# EAGLE design a12008mb (EAGLE 9.2.2)

## Sheet 1 of 3
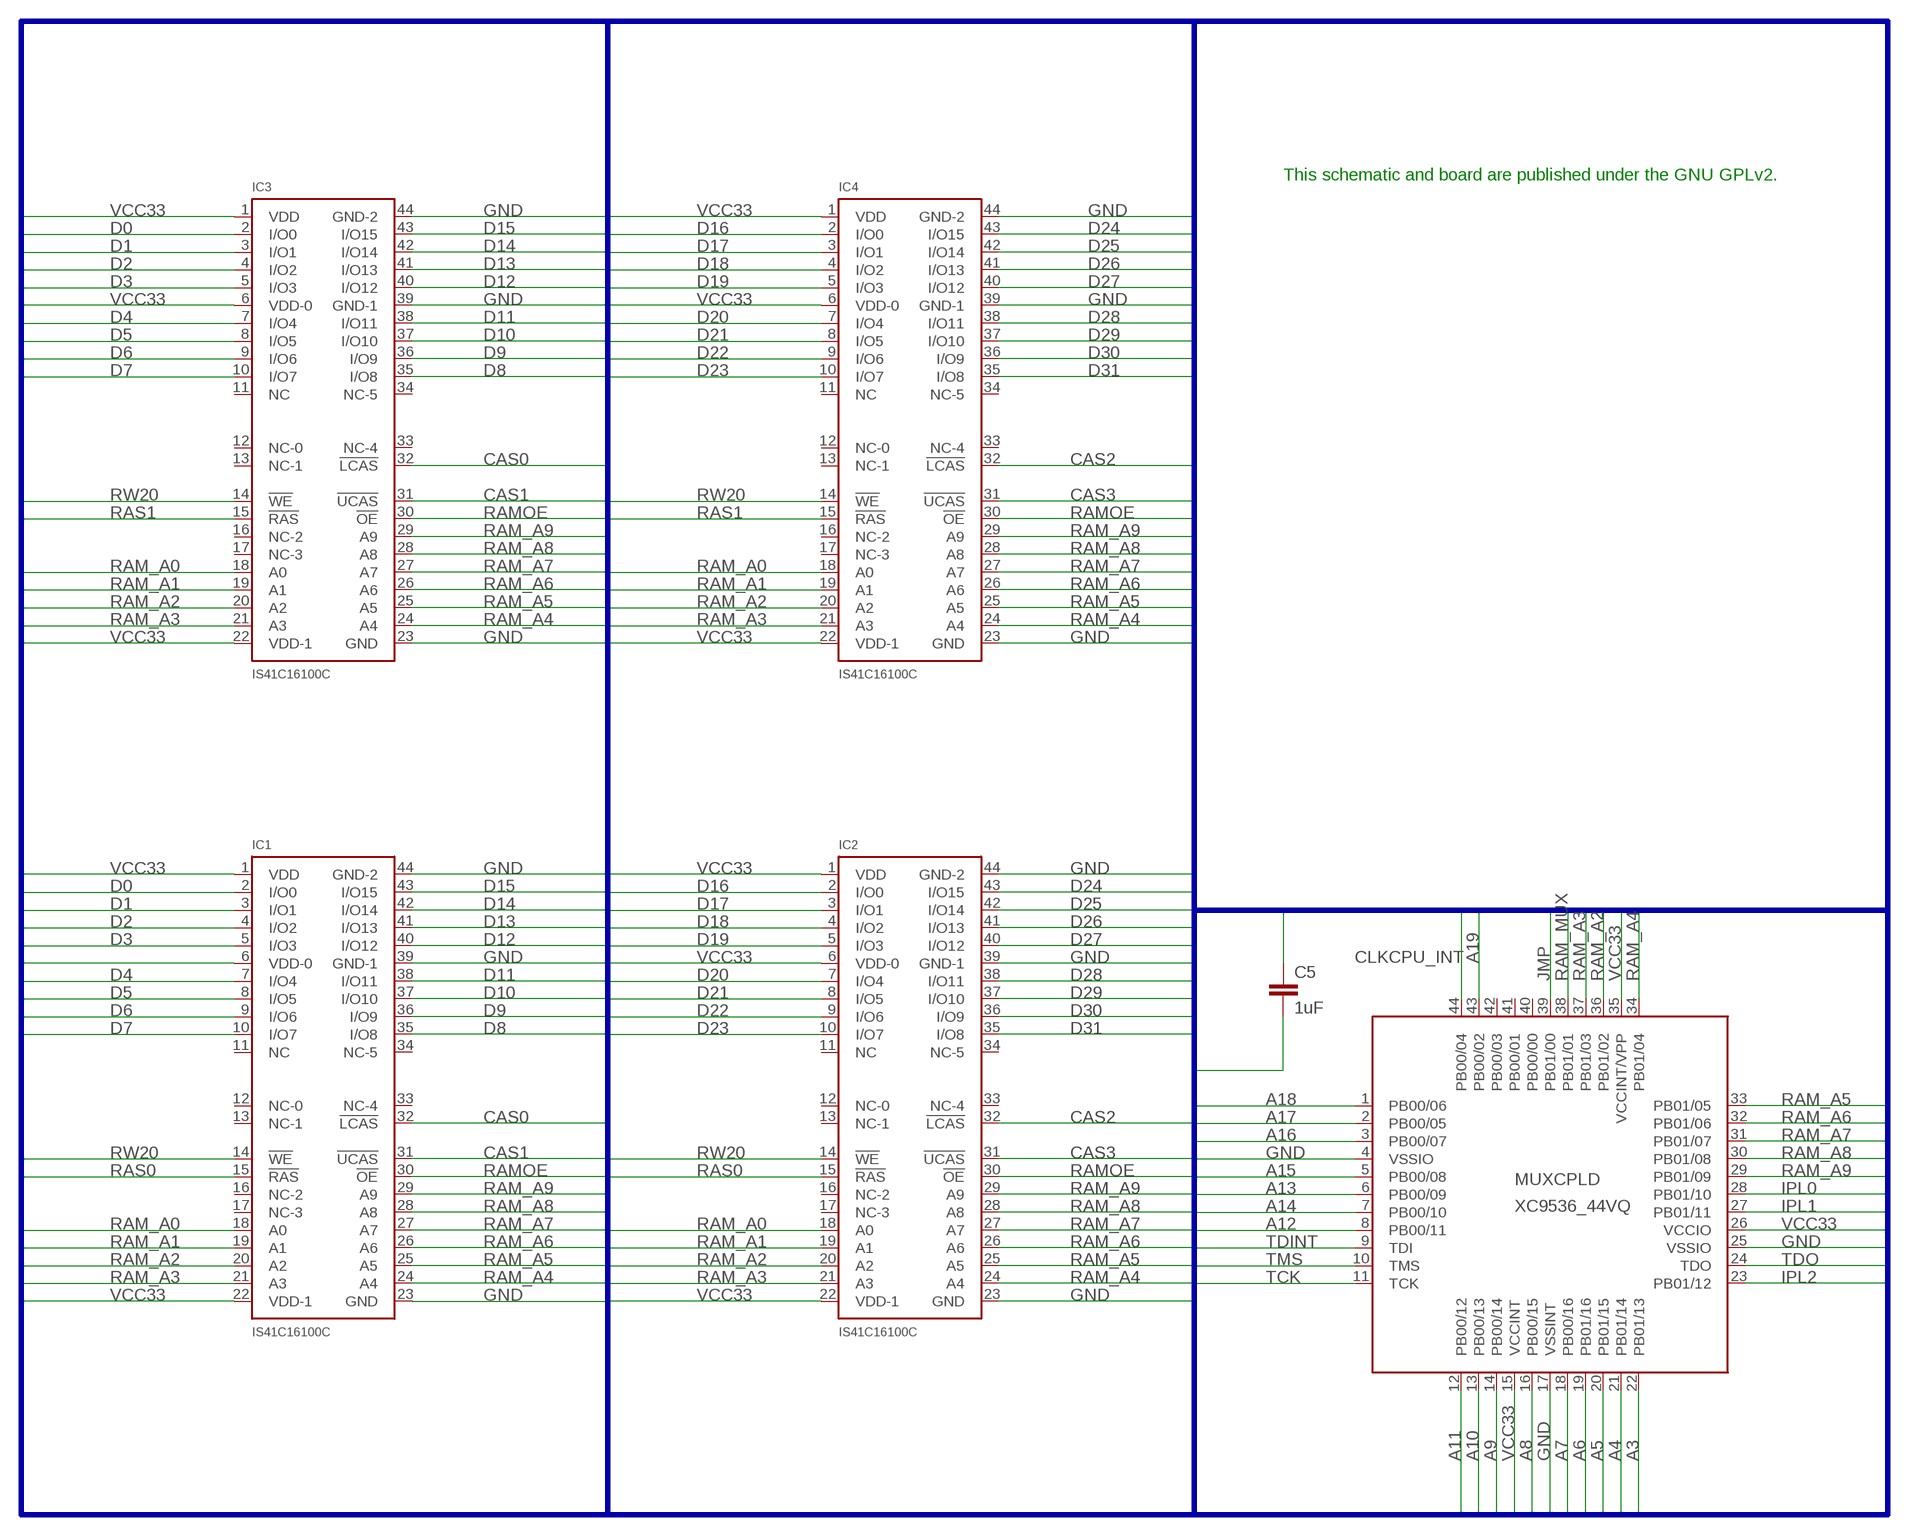
[diagram p0: schematic, sheet 1]

### Parts
C5  1uF  CC1206  [C1206]
IC1  IS41C16100C  [TSOP44(50)-II]
IC2  IS41C16100C  [TSOP44(50)-II]
IC3  IS41C16100C  [TSOP44(50)-II]
IC4  IS41C16100C  [TSOP44(50)-II]
MUXCPLD  XC9536_44VQ  [SQFP-S-10X10-44]

### Nets
A3: MUXCPLD.22(PB01/13) ; also sheet 2,3
A4: MUXCPLD.21(PB01/14) ; also sheet 2,3
A5: MUXCPLD.20(PB01/15) ; also sheet 2,3
A6: MUXCPLD.19(PB01/16) ; also sheet 2,3
A7: MUXCPLD.18(PB00/16) ; also sheet 2
A8: MUXCPLD.16(PB00/15) ; also sheet 2
A9: MUXCPLD.14(PB00/14) ; also sheet 2
A10: MUXCPLD.13(PB00/13) ; also sheet 2
A11: MUXCPLD.12(PB00/12) ; also sheet 2
A12: MUXCPLD.8(PB00/11) ; also sheet 2,3
A13: MUXCPLD.6(PB00/09) ; also sheet 2,3
A14: MUXCPLD.7(PB00/10) ; also sheet 2
A15: MUXCPLD.5(PB00/08) ; also sheet 2,3
A16: MUXCPLD.3(PB00/07) ; also sheet 2,3
A17: MUXCPLD.2(PB00/05) ; also sheet 2,3
A18: MUXCPLD.1(PB00/06) ; also sheet 2,3
A19: MUXCPLD.43(PB00/02) ; also sheet 2,3
CAS0: IC1.32(!LCAS) IC3.32(!LCAS) ; also sheet 3
CAS1: IC1.31(!UCAS) IC3.31(!UCAS) ; also sheet 3
CAS2: IC2.32(!LCAS) IC4.32(!LCAS) ; also sheet 3
CAS3: IC2.31(!UCAS) IC4.31(!UCAS) ; also sheet 3
CLKCPU_INT: MUXCPLD.44(PB00/04)
D0: IC1.2(I/O0) IC3.2(I/O0) ; also sheet 2
D1: IC1.3(I/O1) IC3.3(I/O1) ; also sheet 2
D2: IC1.4(I/O2) IC3.4(I/O2) ; also sheet 2
D3: IC1.5(I/O3) IC3.5(I/O3) ; also sheet 2
D4: IC1.7(I/O4) IC3.7(I/O4) ; also sheet 2
D5: IC1.8(I/O5) IC3.8(I/O5) ; also sheet 2
D6: IC1.9(I/O6) IC3.9(I/O6) ; also sheet 2
D7: IC1.10(I/O7) IC3.10(I/O7) ; also sheet 2
D8: IC1.35(I/O8) IC3.35(I/O8) ; also sheet 2
D9: IC1.36(I/O9) IC3.36(I/O9) ; also sheet 2
D10: IC1.37(I/O10) IC3.37(I/O10) ; also sheet 2
D11: IC1.38(I/O11) IC3.38(I/O11) ; also sheet 2
D12: IC1.40(I/O12) IC3.40(I/O12) ; also sheet 2
D13: IC1.41(I/O13) IC3.41(I/O13) ; also sheet 2
D14: IC1.42(I/O14) IC3.42(I/O14) ; also sheet 2
D15: IC1.43(I/O15) IC3.43(I/O15) ; also sheet 2
D16: IC2.2(I/O0) IC4.2(I/O0) ; also sheet 2
D17: IC2.3(I/O1) IC4.3(I/O1) ; also sheet 2
D18: IC2.4(I/O2) IC4.4(I/O2) ; also sheet 2
D19: IC2.5(I/O3) IC4.5(I/O3) ; also sheet 2
D20: IC2.7(I/O4) IC4.7(I/O4) ; also sheet 2
D21: IC2.8(I/O5) IC4.8(I/O5) ; also sheet 2
D22: IC2.9(I/O6) IC4.9(I/O6) ; also sheet 2
D23: IC2.10(I/O7) IC4.10(I/O7) ; also sheet 2
D24: IC2.43(I/O15) IC4.43(I/O15) ; also sheet 2,3
D25: IC2.42(I/O14) IC4.42(I/O14) ; also sheet 2,3
D26: IC2.41(I/O13) IC4.41(I/O13) ; also sheet 2,3
D27: IC2.40(I/O12) IC4.40(I/O12) ; also sheet 2,3
D28: IC2.38(I/O11) IC4.38(I/O11) ; also sheet 2,3
D29: IC2.37(I/O10) IC4.37(I/O10) ; also sheet 2,3
D30: IC2.36(I/O9) IC4.36(I/O9) ; also sheet 2,3
D31: IC2.35(I/O8) IC4.35(I/O8) ; also sheet 2,3
GND [gnd]: C5.2 IC1.23(GND) IC1.39(GND-1) IC1.44(GND-2) IC2.23(GND) IC2.39(GND-1) IC2.44(GND-2) IC3.23(GND) IC3.39(GND-1) IC3.44(GND-2) IC4.23(GND) IC4.39(GND-1) IC4.44(GND-2) MUXCPLD.4(VSSIO) MUXCPLD.17(VSSINT) MUXCPLD.25(VSSIO) ; also sheet 2,3
IPL0: MUXCPLD.28(PB01/10) ; also sheet 2
IPL1: MUXCPLD.27(PB01/11) ; also sheet 2
IPL2: MUXCPLD.23(PB01/12) ; also sheet 2
JMP: MUXCPLD.39(PB01/00)
RAM_A0: IC1.18(A0) IC2.18(A0) IC3.18(A0) IC4.18(A0) ; also sheet 3
RAM_A1: IC1.19(A1) IC2.19(A1) IC3.19(A1) IC4.19(A1) ; also sheet 3
RAM_A2: IC1.20(A2) IC2.20(A2) IC3.20(A2) IC4.20(A2) MUXCPLD.36(PB01/02)
RAM_A3: IC1.21(A3) IC2.21(A3) IC3.21(A3) IC4.21(A3) MUXCPLD.37(PB01/03)
RAM_A4: IC1.24(A4) IC2.24(A4) IC3.24(A4) IC4.24(A4) MUXCPLD.34(PB01/04)
RAM_A5: IC1.25(A5) IC2.25(A5) IC3.25(A5) IC4.25(A5) MUXCPLD.33(PB01/05)
RAM_A6: IC1.26(A6) IC2.26(A6) IC3.26(A6) IC4.26(A6) MUXCPLD.32(PB01/06)
RAM_A7: IC1.27(A7) IC2.27(A7) IC3.27(A7) IC4.27(A7) MUXCPLD.31(PB01/07)
RAM_A8: IC1.28(A8) IC2.28(A8) IC3.28(A8) IC4.28(A8) MUXCPLD.30(PB01/08)
RAM_A9: IC1.29(A9) IC2.29(A9) IC3.29(A9) IC4.29(A9) MUXCPLD.29(PB01/09)
RAM_MUX: MUXCPLD.38(PB01/01) ; also sheet 3
RAMOE: IC1.30(!OE) IC2.30(!OE) IC3.30(!OE) IC4.30(!OE) ; also sheet 3
RAS0: IC1.15(!RAS) IC2.15(!RAS) ; also sheet 3
RAS1: IC3.15(!RAS) IC4.15(!RAS) ; also sheet 3
RW20: IC1.14(!WE) IC2.14(!WE) IC3.14(!WE) IC4.14(!WE) ; also sheet 2,3
TCK: MUXCPLD.11(TCK) ; also sheet 3
TDINT: MUXCPLD.9(TDI) ; also sheet 3
TDO: MUXCPLD.24(TDO) ; also sheet 3
TMS: MUXCPLD.10(TMS) ; also sheet 3
VCC33 [3v3]: C5.1 IC1.1(VDD) IC1.6(VDD-0) IC1.22(VDD-1) IC2.1(VDD) IC2.6(VDD-0) IC2.22(VDD-1) IC3.1(VDD) IC3.6(VDD-0) IC3.22(VDD-1) IC4.1(VDD) IC4.6(VDD-0) IC4.22(VDD-1) MUXCPLD.15(VCCINT) MUXCPLD.26(VCCIO) MUXCPLD.35(VCCINT/VPP) ; also sheet 3
Unconnected: IC1.11(NC) IC1.12(NC-0) IC1.13(NC-1) IC1.16(NC-2) IC1.17(NC-3) IC1.33(NC-4) IC1.34(NC-5) IC2.11(NC) IC2.12(NC-0) IC2.13(NC-1) IC2.16(NC-2) IC2.17(NC-3) IC2.33(NC-4) IC2.34(NC-5) IC3.11(NC) IC3.12(NC-0) IC3.13(NC-1) IC3.16(NC-2) IC3.17(NC-3) IC3.33(NC-4) IC3.34(NC-5) IC4.11(NC) IC4.12(NC-0) IC4.13(NC-1) IC4.16(NC-2) IC4.17(NC-3) IC4.33(NC-4) IC4.34(NC-5) MUXCPLD.40(PB00/00) MUXCPLD.41(PB00/01) MUXCPLD.42(PB00/03)

### Buses
VCC33,VCC,GND,RW20,D[0..31],RAM_A[0..9],RAM_CAS[0..1],RAMOE,A[0..23],RAM_MUX,RAS[0..1],CAS[0..3],TCK,TMS,TDI,TDO,TDINT,CLKCPU_INT,AS20,DS20,IPL[0..2],JMP

### Notes on the sheet
- This schematic and board are published under the GNU GPLv2.

## Sheet 2 of 3
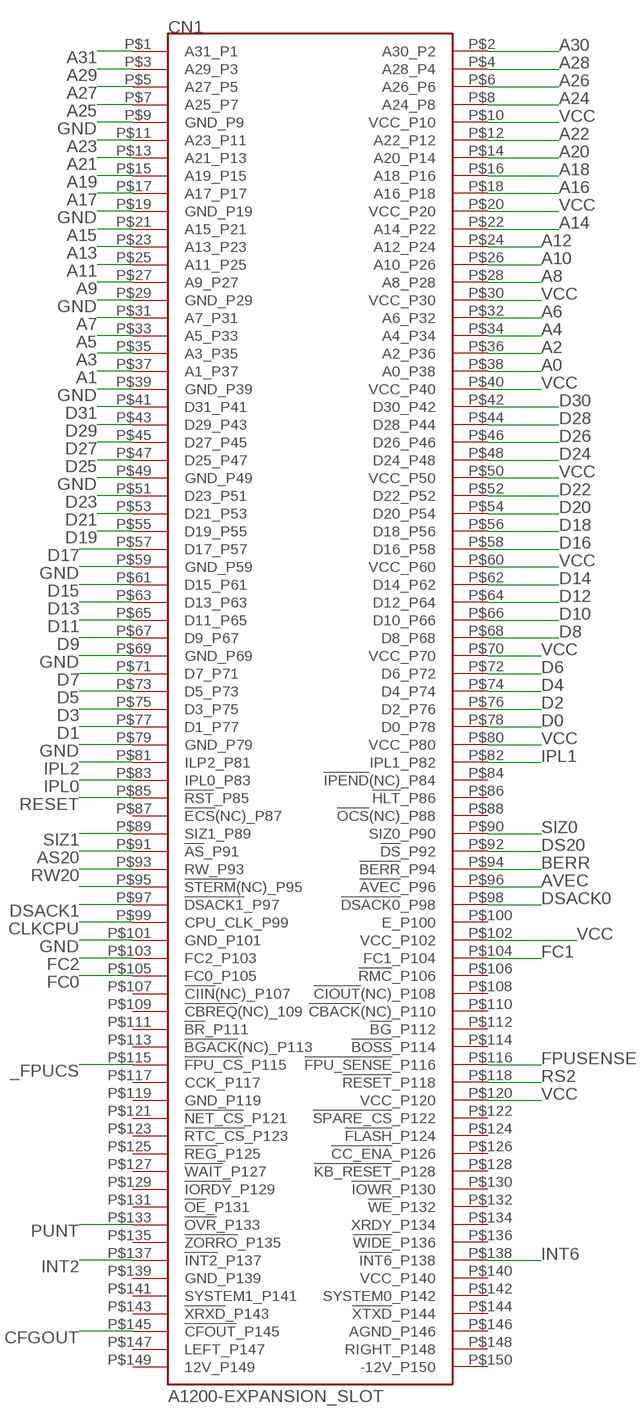
[diagram p1: schematic, sheet 2]

### Parts
CN1  A1200-EXPANSION_SLOT  [CON_150]

### Nets
_FPUCS: CN1.P$115(!FPU_CS!_P115)
A0: CN1.P$38(A0_P38) ; also sheet 3
A1: CN1.P$37(A1_P37) ; also sheet 3
A2: CN1.P$36(A2_P36) ; also sheet 3
A3: CN1.P$35(A3_P35) ; also sheet 1,3
A4: CN1.P$34(A4_P34) ; also sheet 1,3
A5: CN1.P$33(A5_P33) ; also sheet 1,3
A6: CN1.P$32(A6_P32) ; also sheet 1,3
A7: CN1.P$31(A7_P31) ; also sheet 1
A8: CN1.P$28(A8_P28) ; also sheet 1
A9: CN1.P$27(A9_P27) ; also sheet 1
A10: CN1.P$26(A10_P26) ; also sheet 1
A11: CN1.P$25(A11_P25) ; also sheet 1
A12: CN1.P$24(A12_P24) ; also sheet 1,3
A13: CN1.P$23(A13_P23) ; also sheet 1,3
A14: CN1.P$22(A14_P22) ; also sheet 1
A15: CN1.P$21(A15_P21) ; also sheet 1,3
A16: CN1.P$18(A16_P18) ; also sheet 1,3
A17: CN1.P$17(A17_P17) ; also sheet 1,3
A18: CN1.P$16(A18_P16) ; also sheet 1,3
A19: CN1.P$15(A19_P15) ; also sheet 1,3
A20: CN1.P$14(A20_P14) ; also sheet 3
A21: CN1.P$13(A21_P13) ; also sheet 3
A22: CN1.P$12(A22_P12) ; also sheet 3
A23: CN1.P$11(A23_P11) ; also sheet 3
A24: CN1.P$8(A24_P8)
A25: CN1.P$7(A25_P7)
A26: CN1.P$6(A26_P6)
A27: CN1.P$5(A27_P5)
A28: CN1.P$4(A28_P4)
A29: CN1.P$3(A29_P3)
A30: CN1.P$2(A30_P2)
A31: CN1.P$1(A31_P1)
AS20: CN1.P$91(!AS!_P91) ; also sheet 3
AVEC: CN1.P$96(!AVEC!_P96)
BERR: CN1.P$94(!BERR!_P94)
CFGOUT: CN1.P$145(!CFOUT!_P145)
CLKCPU: CN1.P$99(CPU_CLK_P99) ; also sheet 3
D0: CN1.P$78(D0_P78) ; also sheet 1
D1: CN1.P$77(D1_P77) ; also sheet 1
D2: CN1.P$76(D2_P76) ; also sheet 1
D3: CN1.P$75(D3_P75) ; also sheet 1
D4: CN1.P$74(D4_P74) ; also sheet 1
D5: CN1.P$73(D5_P73) ; also sheet 1
D6: CN1.P$72(D6_P72) ; also sheet 1
D7: CN1.P$71(D7_P71) ; also sheet 1
D8: CN1.P$68(D8_P68) ; also sheet 1
D9: CN1.P$67(D9_P67) ; also sheet 1
D10: CN1.P$66(D10_P66) ; also sheet 1
D11: CN1.P$65(D11_P65) ; also sheet 1
D12: CN1.P$64(D12_P64) ; also sheet 1
D13: CN1.P$63(D13_P63) ; also sheet 1
D14: CN1.P$62(D14_P62) ; also sheet 1
D15: CN1.P$61(D15_P61) ; also sheet 1
D16: CN1.P$58(D16_P58) ; also sheet 1
D17: CN1.P$57(D17_P57) ; also sheet 1
D18: CN1.P$56(D18_P56) ; also sheet 1
D19: CN1.P$55(D19_P55) ; also sheet 1
D20: CN1.P$54(D20_P54) ; also sheet 1
D21: CN1.P$53(D21_P53) ; also sheet 1
D22: CN1.P$52(D22_P52) ; also sheet 1
D23: CN1.P$51(D23_P51) ; also sheet 1
D24: CN1.P$48(D24_P48) ; also sheet 1,3
D25: CN1.P$47(D25_P47) ; also sheet 1,3
D26: CN1.P$46(D26_P46) ; also sheet 1,3
D27: CN1.P$45(D27_P45) ; also sheet 1,3
D28: CN1.P$44(D28_P44) ; also sheet 1,3
D29: CN1.P$43(D29_P43) ; also sheet 1,3
D30: CN1.P$42(D30_P42) ; also sheet 1,3
D31: CN1.P$41(D31_P41) ; also sheet 1,3
DS20: CN1.P$92(!DS!_P92) ; also sheet 3
DSACK0: CN1.P$98(!DSACK0!_P98) ; also sheet 3
DSACK1: CN1.P$97(!DSACK1!_P97) ; also sheet 3
FC0: CN1.P$105(FC0_P105)
FC1: CN1.P$104(FC1_P104)
FC2: CN1.P$103(FC2_P103)
FPUSENSE: CN1.P$116(!FPU_SENSE!_P116)
GND [gnd]: CN1.P$9(GND_P9) CN1.P$19(GND_P19) CN1.P$29(GND_P29) CN1.P$39(GND_P39) CN1.P$49(GND_P49) CN1.P$59(GND_P59) CN1.P$69(GND_P69) CN1.P$79(GND_P79) CN1.P$101(GND_P101) ; also sheet 1,3
INT2: CN1.P$137(!INT2!_P137) ; also sheet 3
INT6: CN1.P$138(!INT6!_P138)
IPL0: CN1.P$83(IPL0_P83) ; also sheet 1
IPL1: CN1.P$82(IPL1_P82) ; also sheet 1
IPL2: CN1.P$81(ILP2_P81) ; also sheet 1
N$96: CN1.P$95(!STERM!(NC)_P95)
PUNT: CN1.P$133(!OVR!_P133) ; also sheet 3
RESET: CN1.P$85(!RST!_P85) ; also sheet 3
RS2: CN1.P$118(!RESET!_P118)
RW20: CN1.P$93(RW_P93) ; also sheet 1,3
SIZ0: CN1.P$90(SIZ0_P90) ; also sheet 3
SIZ1: CN1.P$89(SIZ1_P89) ; also sheet 3
VCC [vcc]: CN1.P$10(VCC_P10) CN1.P$20(VCC_P20) CN1.P$30(VCC_P30) CN1.P$40(VCC_P40) CN1.P$50(VCC_P50) CN1.P$60(VCC_P60) CN1.P$70(VCC_P70) CN1.P$80(VCC_P80) CN1.P$102(VCC_P102) CN1.P$120(VCC_P120) ; also sheet 3
Unconnected: CN1.P$84(!IPEND!(NC)_P84) CN1.P$86(!HLT!_P86) CN1.P$87(!ECS!(NC)_P87) CN1.P$88(!OCS!(NC)_P88) CN1.P$100(E_P100) CN1.P$106(!RMC!_P106) CN1.P$107(!CIIN!(NC)_P107) CN1.P$108(!CIOUT!(NC)_P108) CN1.P$109(!CBREQ!(NC)_109) CN1.P$110(!CBACK!(NC)_P110) CN1.P$111(!BR!_P111) CN1.P$112(!BG!_P112) CN1.P$113(!BGACK!(NC)_P113) CN1.P$114(!BOSS!_P114) CN1.P$117(CCK_P117) CN1.P$119(GND_P119) CN1.P$121(!NET_CS!_P121) CN1.P$122(!SPARE_CS!_P122) CN1.P$123(!RTC_CS!_P123) CN1.P$124(!FLASH!_P124) CN1.P$125(!REG!_P125) CN1.P$126(!CC_ENA!_P126) CN1.P$127(!WAIT!_P127) CN1.P$128(!KB_RESET!_P128) CN1.P$129(!IORDY!_P129) CN1.P$130(!IOWR!_P130) CN1.P$131(!OE!_P131) CN1.P$132(!WE!_P132) CN1.P$134(XRDY_P134) CN1.P$135(!ZORRO!_P135) CN1.P$136(!WIDE!_P136) CN1.P$139(GND_P139) CN1.P$140(VCC_P140) CN1.P$141(SYSTEM1_P141) CN1.P$142(SYSTEM0_P142) CN1.P$143(!XRXD!_P143) CN1.P$144(!XTXD!_P144) CN1.P$146(AGND_P146) CN1.P$147(LEFT_P147) CN1.P$148(RIGHT_P148) CN1.P$149(12V_P149) CN1.P$150(-12V_P150)

## Sheet 3 of 3
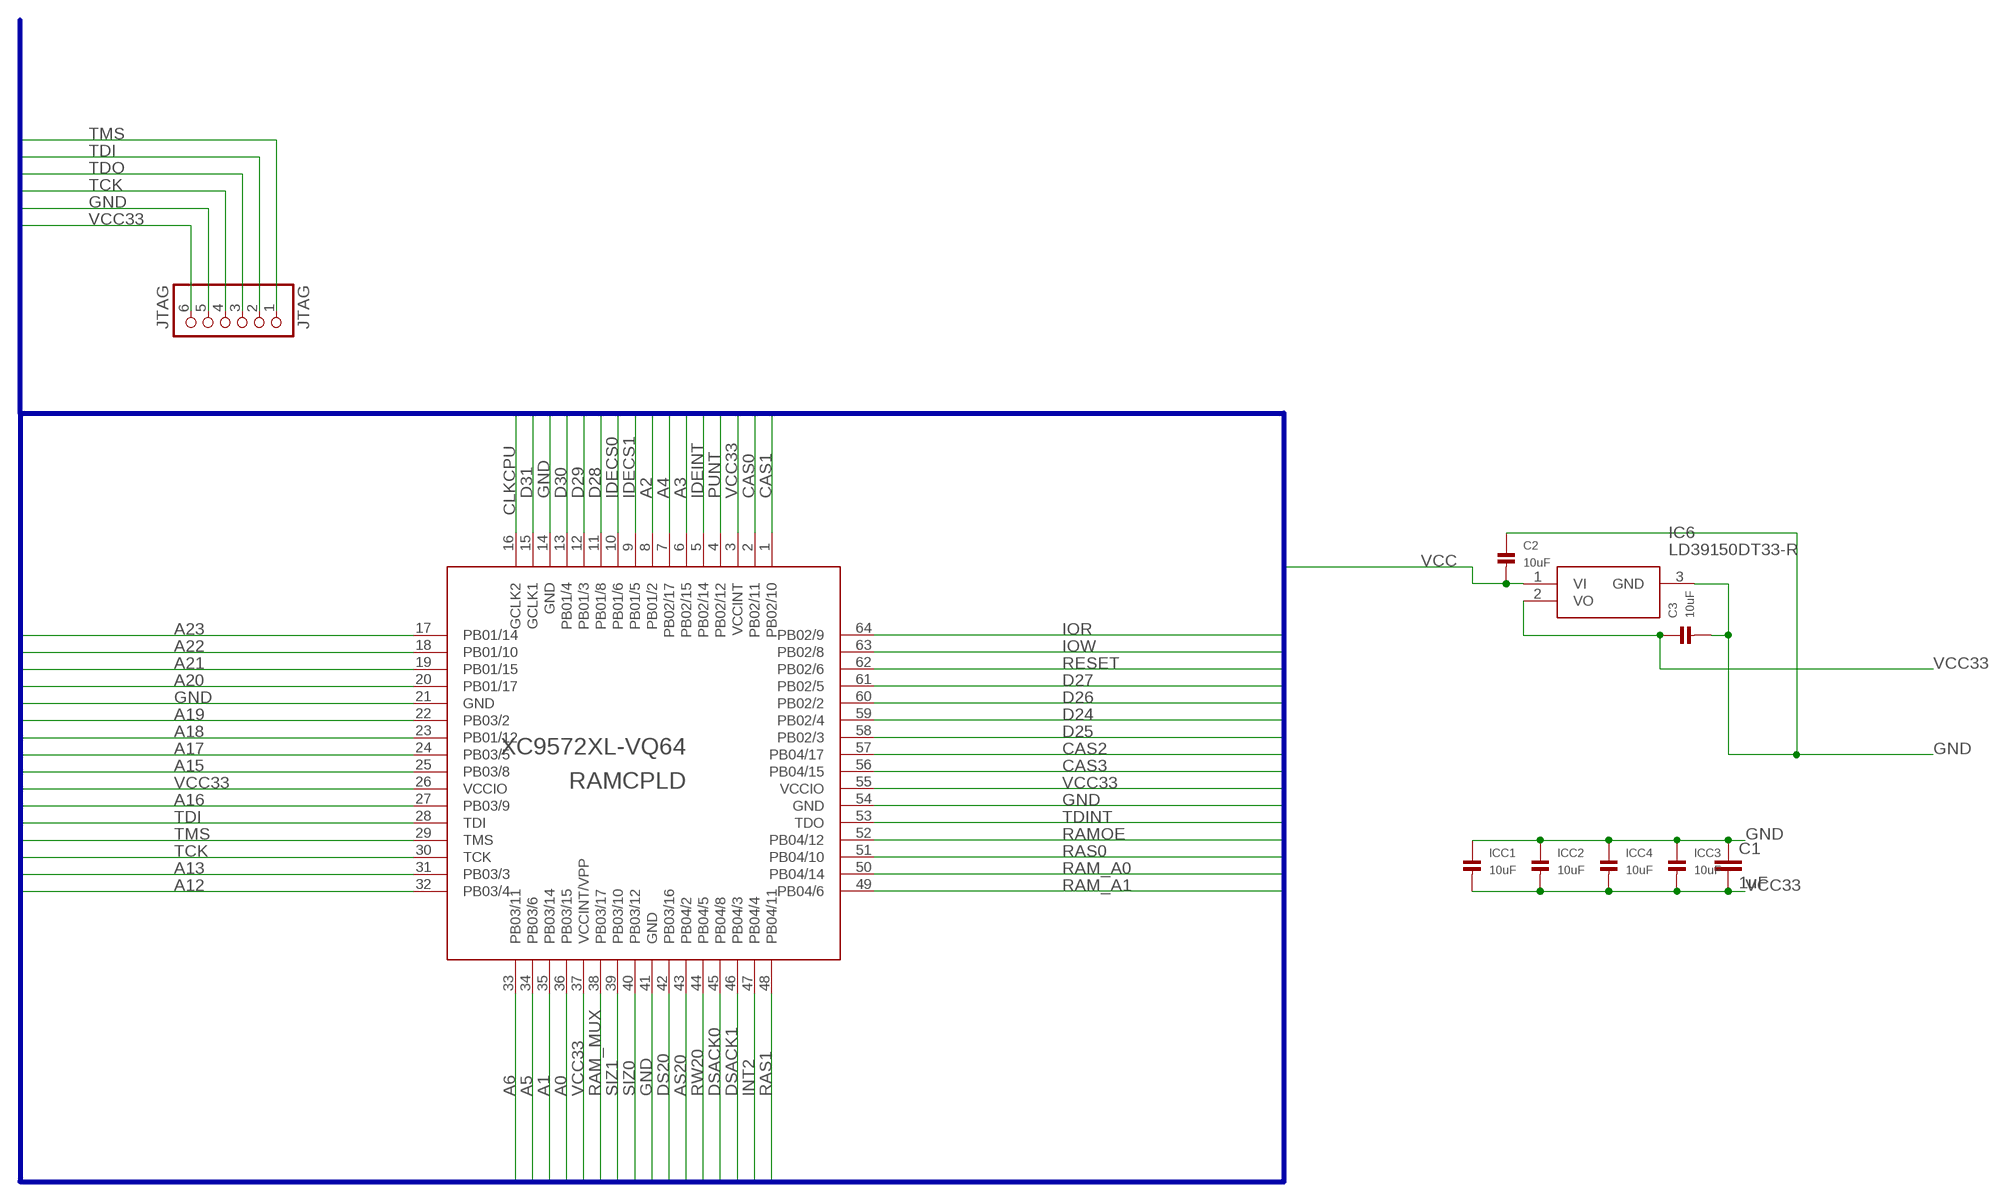
[diagram p2: schematic, sheet 3]

### Parts
C1  1uF  CC1206  [C1206]
C2  10uF  CAP_CERAMIC1206  [1206]
C3  10uF  CAP_CERAMIC1206  [1206]
IC6  LD39150DT33-R  [STD5N52U]
ICC1  10uF  CAP_CERAMIC1206  [1206]
ICC2  10uF  CAP_CERAMIC1206  [1206]
ICC3  10uF  CAP_CERAMIC1206  [1206]
ICC4  10uF  CAP_CERAMIC1206  [1206]
JTAG  JTAG  HEADER-1X6ROUND  [1X06_ROUND]
RAMCPLD  XC9572XL-VQ64  [VQ64]

### Nets
A0: RAMCPLD.36(PB03/15) ; also sheet 2
A1: RAMCPLD.35(PB03/14) ; also sheet 2
A2: RAMCPLD.8(PB01/2) ; also sheet 2
A3: RAMCPLD.6(PB02/15) ; also sheet 1,2
A4: RAMCPLD.7(PB02/17) ; also sheet 1,2
A5: RAMCPLD.34(PB03/6) ; also sheet 1,2
A6: RAMCPLD.33(PB03/11) ; also sheet 1,2
A12: RAMCPLD.32(PB03/4) ; also sheet 1,2
A13: RAMCPLD.31(PB03/3) ; also sheet 1,2
A15: RAMCPLD.25(PB03/8) ; also sheet 1,2
A16: RAMCPLD.27(PB03/9) ; also sheet 1,2
A17: RAMCPLD.24(PB03/5) ; also sheet 1,2
A18: RAMCPLD.23(PB01/12) ; also sheet 1,2
A19: RAMCPLD.22(PB03/2) ; also sheet 1,2
A20: RAMCPLD.20(PB01/17) ; also sheet 2
A21: RAMCPLD.19(PB01/15) ; also sheet 2
A22: RAMCPLD.18(PB01/10) ; also sheet 2
A23: RAMCPLD.17(PB01/14) ; also sheet 2
AS20: RAMCPLD.43(PB04/2) ; also sheet 2
CAS0: RAMCPLD.2(PB02/11) ; also sheet 1
CAS1: RAMCPLD.1(PB02/10) ; also sheet 1
CAS2: RAMCPLD.57(PB04/17) ; also sheet 1
CAS3: RAMCPLD.56(PB04/15) ; also sheet 1
CLKCPU: RAMCPLD.16(GCLK2) ; also sheet 2
D24: RAMCPLD.59(PB02/4) ; also sheet 1,2
D25: RAMCPLD.58(PB02/3) ; also sheet 1,2
D26: RAMCPLD.60(PB02/2) ; also sheet 1,2
D27: RAMCPLD.61(PB02/5) ; also sheet 1,2
D28: RAMCPLD.11(PB01/8) ; also sheet 1,2
D29: RAMCPLD.12(PB01/3) ; also sheet 1,2
D30: RAMCPLD.13(PB01/4) ; also sheet 1,2
D31: RAMCPLD.15(GCLK1) ; also sheet 1,2
DS20: RAMCPLD.42(PB03/16) ; also sheet 2
DSACK0: RAMCPLD.45(PB04/8) ; also sheet 2
DSACK1: RAMCPLD.46(PB04/3) ; also sheet 2
GND [gnd]: C1.1 C2.1 C3.2 IC6.3(GND) ICC1.1 ICC2.1 ICC3.1 ICC4.1 JTAG.5 RAMCPLD.14(GND) RAMCPLD.21(GND) RAMCPLD.41(GND) RAMCPLD.54(GND) ; also sheet 1,2
IDECS0: RAMCPLD.10(PB01/6)
IDECS1: RAMCPLD.9(PB01/5)
IDEINT: RAMCPLD.5(PB02/14)
INT2: RAMCPLD.47(PB04/4) ; also sheet 2
IOR: RAMCPLD.64(PB02/9)
IOW: RAMCPLD.63(PB02/8)
PUNT: RAMCPLD.4(PB02/12) ; also sheet 2
RAM_A0: RAMCPLD.50(PB04/14) ; also sheet 1
RAM_A1: RAMCPLD.49(PB04/6) ; also sheet 1
RAM_MUX: RAMCPLD.38(PB03/17) ; also sheet 1
RAMOE: RAMCPLD.52(PB04/12) ; also sheet 1
RAS0: RAMCPLD.51(PB04/10) ; also sheet 1
RAS1: RAMCPLD.48(PB04/11) ; also sheet 1
RESET: RAMCPLD.62(PB02/6) ; also sheet 2
RW20: RAMCPLD.44(PB04/5) ; also sheet 1,2
SIZ0: RAMCPLD.40(PB03/12) ; also sheet 2
SIZ1: RAMCPLD.39(PB03/10) ; also sheet 2
TCK: JTAG.4 RAMCPLD.30(TCK) ; also sheet 1
TDI: JTAG.2 RAMCPLD.28(TDI)
TDINT: RAMCPLD.53(TDO) ; also sheet 1
TDO: JTAG.3 ; also sheet 1
TMS: JTAG.1 RAMCPLD.29(TMS) ; also sheet 1
VCC [vcc]: C2.2 IC6.1(VI) ; also sheet 2
VCC33 [3v3]: C1.2 C3.1 IC6.2(VO) ICC1.2 ICC2.2 ICC3.2 ICC4.2 JTAG.6 RAMCPLD.3(VCCINT) RAMCPLD.26(VCCIO) RAMCPLD.37(VCCINT/VPP) RAMCPLD.55(VCCIO) ; also sheet 1

### Buses
VCC33,VCC,GND,CLK7M,A[0..31],D[0..31],IPL[0..2],FC[0..2],DSACK[0..1],BR,BGACK,RW20,CLKCPU,CLKCPU_INT,AS20,DS20,BG20,AVEC,SIZ[0..1],DBEN,BERR,RESET,HALT,BG,VPA,VMA,E,AS,UDS,LDS,DTACK,CPCS,CPSENSE,CDIS,MMUDIS,IOR,IOW,INT2,IDECS[0..1],IDELED,IDEWAIT,IDEINT,RAMOE,RAMCS[0..3],INTSIG[0..4],TCK,TMS,TDI,TDO,TDINT,RAM_MUX,RAM_A[0..9],RAS[0..1],CAS[0..3],RTC_CS,SPARE_CS,INT6,PUNT

## Library data of the parts
C1 C5 = eagle-ltspice:C: CAPACITOR, European symbol; SPICEMODEL: NONE; SPICEPREFIX: C
C2 C3 ICC1-ICC4 = microbuilder:CAP_CERAMIC: Ceramic Capacitors 0402 - 0402 Surface Mount Capacitors 16pF 50V 5% [Digikey: 445-4899-2-ND] 18pF 50V 5% [Digikey: 490-1281-2-ND] 22pF 50V 5% [Digikey: 490-1283-2-ND] 68pF 50V 5% [Digikey: 490-1289-2-ND] 0.1uF 10V 10% [Digikey: 490-1318-2-ND] 1.0uF 6.3V 10% [Digikey: 490-1320-2-ND] 0603 - 0603 Surface Mount Capacitors 16 pF 50V 5% [Digikey: 445-5051-2-ND] 22 pF 50V [Digikey: PCC220ACVTR-ND] 33 pF 50V 5% [Digikey: 490-1415-1-ND] 56pF 50V 5% [Digikey: 490-1421-1-ND] 220pF 50V 5% [Digikey: 445-1285-1-ND] 680 pF 50V 2200 pF 50V 5% C0G [Digikey: 445-1297-1-ND] 5600 pF 100V 5% X7R [Digikey: 478-3711-1-ND] 0.1 µF 25V 10% [Digikey: PCC2277TR-ND] 0.22 µF 16V 10% X7R [Digikey: 445-1318-1-ND] 1.0 µF 25V 10% [Digikey: 445-5146-2-ND] 0603 - RF Specific 3pF 250V +/-0.1pF RF [Digikey: 712-1347-1-ND] 18 pF 250V 5% [Digikey: 478-3505-1-ND or 712-1322-1-ND] 56 pF 250V 5% C0G RF [Digikey: 490-4867-1-ND] 68 pF 250V RF [Digikey: 490-4868-1-ND] 0805 - 0805 Surface Mount Capacitors 220 pF 250V 2% RF Ceramic Capacitor [Digikey: 712-1398-1-ND] 1000 pF 50V 2% NP0 Ceramic Capacitor [Digikey: 478-3760-1-ND] 0.1 µF 25V 10% Ceramic Capacitor [Digikey: PCC1828TR-ND] 1.0 µF 16V 10% Ceramic Capacitor[Digikey: 490-1691-2-ND] 10.0 µF 10V 10% Ceramic Capacitor[Digikey: 709-1228-1-ND] 10.0 uF 16V 10% Ceramic Capacitor [Digikey: 478-5165-2-ND] 47 uF 6.3V 20% Ceramic Capacitor [Digikey: 587-1779-1-ND or 399-5506-1-ND] 1206 - 1206 Surface Mount Capacitors 47uF 10V 20% Ceramic Capacitor [Digikey: 490-5528-1-ND or 399-5508-1-ND or 445-6010-1-ND] 100uF 6.3V -20%, +80% Y5V Ceramic Capacitor (Digikey: 490-4512-1-ND, Mouser: 81-GRM31CF50J107ZE1L)
CN1 = Amiga:A1200-EXPANSION
IC1-IC4 = IS41C16100C:IS41C16100C
IC6 = LD39150DT33-R:LD39150DT33-R: STMICROELECTRONICS - LD39150DT33-R - LDO, FIXED, 3.3V, 1.5A, TO-251-3 Source: Datasheet <https://www.st.com/resource/en/datasheet/ld39150.pdf>; DESCRIPTION: STMICROELECTRONICS - LD39150DT33-R - LDO, FIXED, 3.3V, 1.5A, TO-251-3; HEIGHT: 2mm; MANUFACTURER_NAME: STMicroelectronics; MANUFACTURER_PART_NUMBER: LD39150DT33-R; MOUSER_PART_NUMBER: 511-LD39150DT33-R; MOUSER_PRICE-STOCK: https://www.mouser.com/Search/Refine.aspx?Keyword=511-LD39150DT33-R
JTAG = microbuilder:HEADER-1X6: PIN HEADER
MUXCPLD = xilinx-xc9:XC9536_44VQ: xc9536_pc44 XC9500 In-System Programmable CPLD Family Auto generated by make-symbol-device-package-bsdl.ulp Rev. 34 Source: xc9536_vq44.bsd; MPN: XC9536-15VQG44C; OC_FARNELL: 1193227; OC_NEWARK: 98K3377
RAMCPLD = terriblefire:XC9572XL-VQ64

## Net classes
1 vcc: width 0.457 mm
2 3v3: width 0.254 mm
3 gnd: width 0.254 mm

## Board
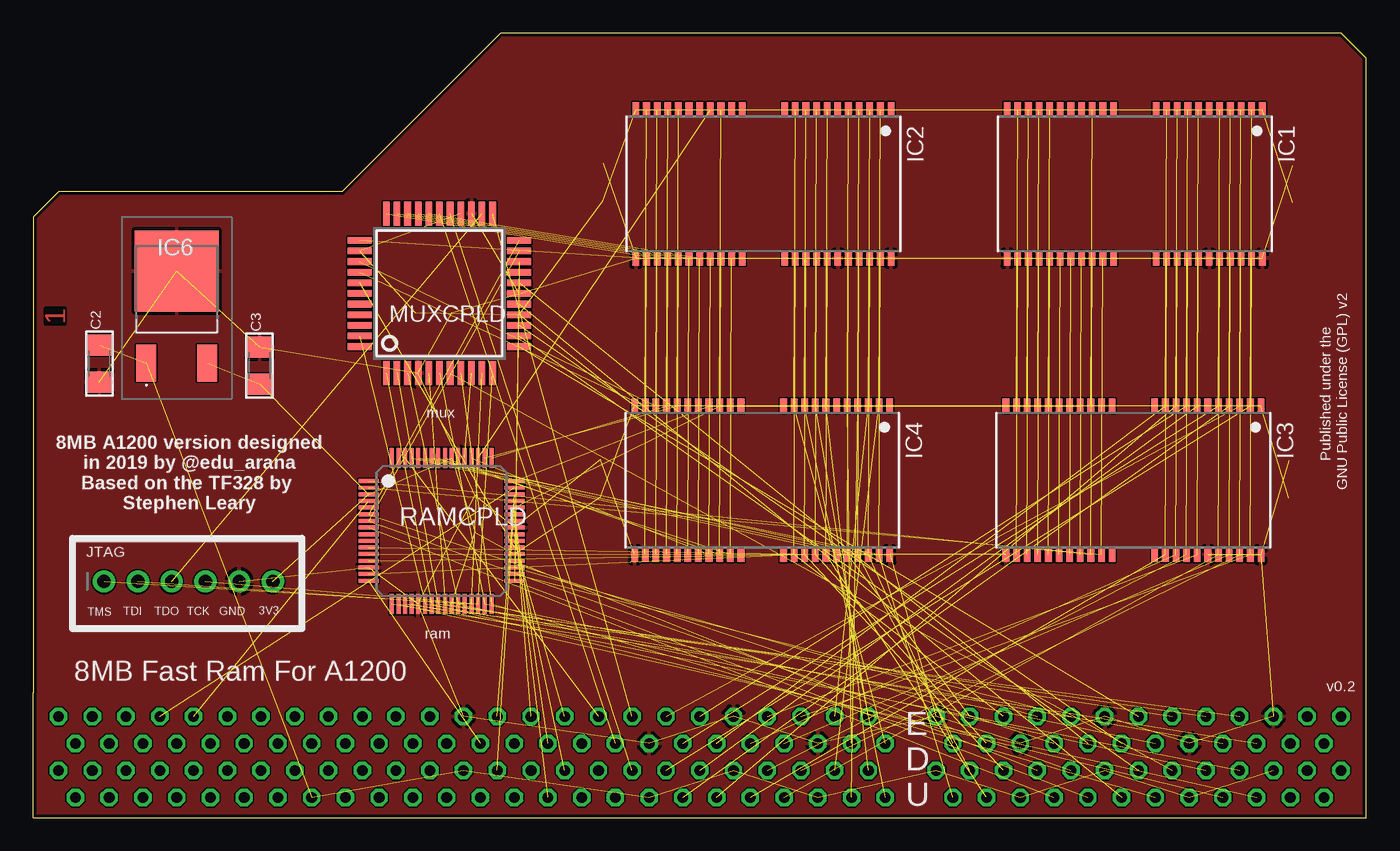
[diagram p3: board, top side]
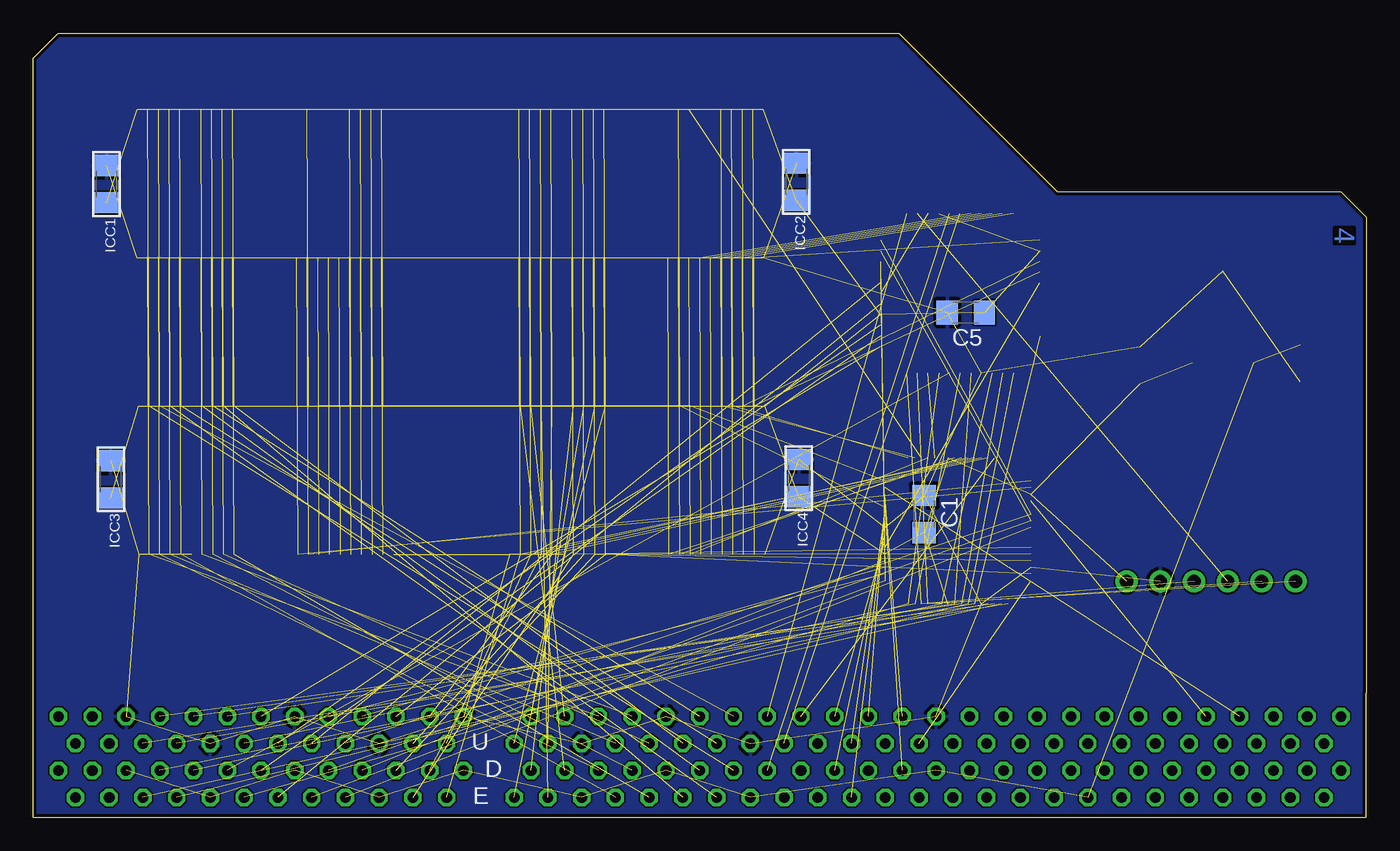
[diagram p4: board, bottom side, seen from below]

Size 100.33 x 59.05 mm. Coordinates in mm from the lower left corner, seen from the top.
Outline: 0,0 100.31,0 100.31,57.17
Outline: 100.31,57.17 100.31,57.18 98.44,59.05 35.18,59.05 33.4,57.27 23.24,47.12 21.72,47.12 1.91,47.12 0,45.21 0,9.4
Copper layers (1*2*15*16): Top 0.035mm / dielectric 0.2mm / Route2 0.0175mm / dielectric 1.2mm / Route15 0.0175mm / dielectric 0.2mm / Bottom 0.035mm
Design rules "dirtypcbs_4_layer *": minimum track width 8mil, minimum drill 12mil, track to track 5mil, track to pad 5mil, pad to pad 5mil, via to via 5mil, smd to smd 0mil, copper to edge 10mil, drill to drill 10mil, minimum pad ring 10mil, minimum via ring 6mil, stop-mask expansion 2mil, vias tented up to drill 25mil, thermal gap 10mil

### Footprints (pad centres in the part's own frame; a part is rotated, then mirrored left to right if it is on the bottom)
C1206 = smd 1.6 x 1.8: 1 -1.4,0; 2 1.4,0
1206 = smd 1.6 x 1.8: 1 -1.4,0; 2 1.4,0
CON_150 = drill 0.8 octagon: P$1 32.385,-3.81; P$2 32.385,0.254; P$3 31.115,-1.778; P$4 31.115,2.286; P$5 29.845,-3.81; P$6 29.845,0.254; P$7 28.575,-1.778; P$8 28.575,2.286; P$9 27.305,-3.81; P$10 27.305,0.254; P$11 26.035,-1.778; P$12 26.035,2.286; P$13 24.765,-3.81; P$14 24.765,0.254; P$15 23.495,-1.778; P$16 23.495,2.286; P$17 22.225,-3.81; P$18 22.225,0.254; P$19 20.955,-1.778; P$20 20.955,2.286; P$21 19.685,-3.81; P$22 19.685,0.254; P$23 18.415,-1.778; P$24 18.415,2.286; P$25 17.145,-3.81; P$26 17.145,0.254; P$27 15.875,-1.778; P$28 15.875,2.286; P$29 14.605,-3.81; P$30 14.605,0.254; P$31 13.335,-1.778; P$32 13.335,2.286; P$33 12.065,-3.81; P$34 12.065,0.254; P$35 10.795,-1.778; P$36 10.795,2.286; P$37 9.525,-3.81; P$38 9.525,0.254; P$39 8.255,-1.778; P$40 8.255,2.286; P$41 6.985,-3.81; P$42 6.985,0.254; P$43 5.715,-1.778; P$44 5.715,2.286; P$45 4.445,-3.81; P$46 4.445,0.254; P$47 3.175,-1.778; P$48 3.175,2.286; P$49 1.905,-3.81; P$50 1.905,0.254; P$51 -1.905,-1.778; P$52 -1.905,2.286; P$53 -3.175,-3.81; P$54 -3.175,0.254; P$55 -4.445,-1.778; P$56 -4.445,2.286; P$57 -5.715,-3.81; P$58 -5.715,0.254; P$59 -6.985,-1.778; P$60 -6.985,2.286; P$61 -8.255,-3.81; P$62 -8.255,0.254; P$63 -9.525,-1.778; P$64 -9.525,2.286; P$65 -10.795,-3.81; P$66 -10.795,0.254; P$67 -12.065,-1.778; P$68 -12.065,2.286; P$69 -13.335,-3.81; P$70 -13.335,0.254; P$71 -14.605,-1.778; P$72 -14.605,2.286; P$73 -15.875,-3.81; P$74 -15.875,0.254; P$75 -17.145,-1.778; P$76 -17.145,2.286; P$77 -18.415,-3.81; P$78 -18.415,0.254; P$79 -19.685,-1.778; P$80 -19.685,2.286; P$81 -20.955,-3.81; P$82 -20.955,0.254; P$83 -22.225,-1.778; P$84 -22.225,2.286; P$85 -23.495,-3.81; P$86 -23.495,0.254; P$87 -24.765,-1.778; P$88 -24.765,2.286; P$89 -26.035,-3.81; P$90 -26.035,0.254; P$91 -27.305,-1.778; P$92 -27.305,2.286; P$93 -28.575,-3.81; P$94 -28.575,0.254; P$95 -29.845,-1.778; P$96 -29.845,2.286; P$97 -31.115,-3.81; P$98 -31.115,0.254; P$99 -32.385,-1.778; P$100 -32.385,2.286; P$101 -33.655,-3.81; P$102 -33.655,0.254; P$103 -34.925,-1.778; P$104 -34.925,2.286; P$105 -36.195,-3.81; P$106 -36.195,0.254; P$107 -37.465,-1.778; P$108 -37.465,2.286; P$109 -38.735,-3.81; P$110 -38.735,0.254; P$111 -40.005,-1.778; P$112 -40.005,2.286; P$113 -41.275,-3.81; P$114 -41.275,0.254; P$115 -42.545,-1.778; P$116 -42.545,2.286; P$117 -43.815,-3.81; P$118 -43.815,0.254; P$119 -45.085,-1.778; P$120 -45.085,2.286; P$121 -46.355,-3.81; P$122 -46.355,0.254; P$123 -47.625,-1.778; P$124 -47.625,2.286; P$125 -48.895,-3.81; P$126 -48.895,0.254; P$127 -50.165,-1.778; P$128 -50.165,2.286; P$129 -51.435,-3.81; P$130 -51.435,0.254; P$131 -52.705,-1.778; P$132 -52.705,2.286; P$133 -53.975,-3.81; P$134 -53.975,0.254; P$135 -55.245,-1.778; P$136 -55.245,2.286; P$137 -56.515,-3.81; P$138 -56.515,0.254; P$139 -57.785,-1.778; P$140 -57.785,2.286; P$141 -59.055,-3.81; P$142 -59.055,0.254; P$143 -60.325,-1.778; P$144 -60.325,2.286; P$145 -61.595,-3.81; P$146 -61.595,0.254; P$147 -62.865,-1.778; P$148 -62.865,2.286; P$149 -64.135,-3.81; P$150 -64.135,0.254
TSOP44(50)-II = smd 0.5 x 1.1: 1 -9.6,-5.6; 2 -8.8,-5.6; 3 -8,-5.6; 4 -7.2,-5.6; 5 -6.4,-5.6; 6 -5.6,-5.6; 7 -4.8,-5.6; 8 -4,-5.6; 9 -3.2,-5.6; 10 -2.4,-5.6; 11 -1.6,-5.6; 12 1.6,-5.6; 13 2.4,-5.6; 14 3.2,-5.6; 15 4,-5.6; 16 4.8,-5.6; 17 5.6,-5.6; 18 6.4,-5.6; 19 7.2,-5.6; 20 8,-5.6; 21 8.8,-5.6; 22 9.6,-5.6; 23 9.6,5.6; 24 8.8,5.6; 25 8,5.6; 26 7.2,5.6; 27 6.4,5.6; 28 5.6,5.6; 29 4.8,5.6; 30 4,5.6; 31 3.2,5.6; 32 2.4,5.6; 33 1.6,5.6; 34 -1.6,5.6; 35 -2.4,5.6; 36 -3.2,5.6; 37 -4,5.6; 38 -4.8,5.6; 39 -5.6,5.6; 40 -6.4,5.6; 41 -7.2,5.6; 42 -8,5.6; 43 -8.8,5.6; 44 -9.6,5.6
STD5N52U = smd 1.5 x 2.8: 1 -2.286,-4.137; 2 2.286,-4.137 | smd 6.3 x 6.1: 3 0,2.798
1X06_ROUND = drill 1 pad 1.676: 1 -6.35,0; 2 -3.81,0; 3 -1.27,0; 4 1.27,0; 5 3.81,0; 6 6.35,0
SQFP-S-10X10-44 = smd 0.5 x 1.8: 1 -4,-6; 2 -3.2,-6; 3 -2.4,-6; 4 -1.6,-6; 5 -0.8,-6; 6 0,-6; 7 0.8,-6; 8 1.6,-6; 9 2.4,-6; 10 3.2,-6; 11 4,-6; 23 4,6; 24 3.2,6; 25 2.4,6; 26 1.6,6; 27 0.8,6; 28 0,6; 29 -0.8,6; 30 -1.6,6; 31 -2.4,6; 32 -3.2,6; 33 -4,6 | smd 1.8 x 0.5: 12 6,-4; 13 6,-3.2; 14 6,-2.4; 15 6,-1.6; 16 6,-0.8; 17 6,0; 18 6,0.8; 19 6,1.6; 20 6,2.4; 21 6,3.2; 22 6,4; 34 -6,4; 35 -6,3.2; 36 -6,2.4; 37 -6,1.6; 38 -6,0.8; 39 -6,0; 40 -6,-0.8; 41 -6,-1.6; 42 -6,-2.4; 43 -6,-3.2; 44 -6,-4
VQ64 = smd 1.5 x 0.3: 1 -5.5,3.75; 2 -5.5,3.25; 3 -5.5,2.75; 4 -5.5,2.25; 5 -5.5,1.75; 6 -5.5,1.25; 7 -5.5,0.75; 8 -5.5,0.25; 9 -5.5,-0.25; 10 -5.5,-0.75; 11 -5.5,-1.25; 12 -5.5,-1.75; 13 -5.5,-2.25; 14 -5.5,-2.75; 15 -5.5,-3.25; 16 -5.5,-3.75; 33 5.5,-3.75; 34 5.5,-3.25; 35 5.5,-2.75; 36 5.5,-2.25; 37 5.5,-1.75; 38 5.5,-1.25; 39 5.5,-0.75; 40 5.5,-0.25; 41 5.5,0.25; 42 5.5,0.75; 43 5.5,1.25; 44 5.5,1.75; 45 5.5,2.25; 46 5.5,2.75; 47 5.5,3.25; 48 5.5,3.75 | smd 0.3 x 1.5: 17 -3.75,-5.5; 18 -3.25,-5.5; 19 -2.75,-5.5; 20 -2.25,-5.5; 21 -1.75,-5.5; 22 -1.25,-5.5; 23 -0.75,-5.5; 24 -0.25,-5.5; 25 0.25,-5.5; 26 0.75,-5.5; 27 1.25,-5.5; 28 1.75,-5.5; 29 2.25,-5.5; 30 2.75,-5.5; 31 3.25,-5.5; 32 3.75,-5.5; 49 3.75,5.5; 50 3.25,5.5; 51 2.75,5.5; 52 2.25,5.5; 53 1.75,5.5; 54 1.25,5.5; 55 0.75,5.5; 56 0.25,5.5; 57 -0.25,5.5; 58 -0.75,5.5; 59 -1.25,5.5; 60 -1.75,5.5; 61 -2.25,5.5; 62 -2.75,5.5; 63 -3.25,5.5; 64 -3.75,5.5

### Placement (x,y rotation side)
C1  33.27,22.86 270 bottom
C2  4.97,34.19 90 top
C3  17.03,34.04 90 top
C5  30.14,38.04 180 bottom
CN1  66.04,3.81 180 bottom
IC1  82.9,47.71 180 top
IC2  54.96,47.71 180 top
IC3  82.8,25.4 180 top
IC4  54.86,25.4 180 top
IC6  10.8,38.36 0 top
ICC1  94.82,47.7 270 bottom
ICC2  42.9,47.87 270 bottom
ICC3  94.49,25.47 270 bottom
ICC4  42.71,25.56 270 bottom
JTAG  11.68,17.78 0 top
MUXCPLD  30.58,39.47 0 top
RAMCPLD  30.73,21.59 0 top

### Tracks (layer width: path | path; a pad name or v marks a point on that pad's centre or on a via)
A0  (1 unrouted)
A1  (1 unrouted)
A2  (1 unrouted)
A3  (2 unrouted)
A4  (2 unrouted)
A5  (2 unrouted)
A6  (2 unrouted)
A7  (1 unrouted)
A8  (1 unrouted)
A9  (1 unrouted)
A10  (1 unrouted)
A11  (1 unrouted)
A12  (2 unrouted)
A13  (2 unrouted)
A14  (1 unrouted)
A15  (2 unrouted)
A16  (2 unrouted)
A17  (2 unrouted)
A18  (2 unrouted)
A19  (2 unrouted)
A20  (1 unrouted)
A21  (1 unrouted)
A22  (1 unrouted)
A23  (1 unrouted)
AS20  (1 unrouted)
CAS0  (2 unrouted)
CAS1  (2 unrouted)
CAS2  (2 unrouted)
CAS3  (2 unrouted)
CLKCPU  (1 unrouted)
D0  (2 unrouted)
D1  (2 unrouted)
D2  (2 unrouted)
D3  (2 unrouted)
D4  (2 unrouted)
D5  (2 unrouted)
D6  (2 unrouted)
D7  (2 unrouted)
D8  (2 unrouted)
D9  (2 unrouted)
D10  (2 unrouted)
D11  (2 unrouted)
D12  (2 unrouted)
D13  (2 unrouted)
D14  (2 unrouted)
D15  (2 unrouted)
D16  (2 unrouted)
D17  (2 unrouted)
D18  (2 unrouted)
D19  (2 unrouted)
D20  (2 unrouted)
D21  (2 unrouted)
D22  (2 unrouted)
D23  (2 unrouted)
D24  (3 unrouted)
D25  (3 unrouted)
D26  (3 unrouted)
D27  (3 unrouted)
D28  (3 unrouted)
D29  (3 unrouted)
D30  (3 unrouted)
D31  (3 unrouted)
DS20  (1 unrouted)
DSACK0  (1 unrouted)
DSACK1  (1 unrouted)
GND  (37 unrouted)
  pour Bottom: -2.35,61.32 103.47,61.32 103.47,-2.64 -2.35,-2.64
  pour Top: -2.48,61.48 103.46,61.48 103.46,-2.33 -2.48,-2.33
INT2  (1 unrouted)
IPL0  (1 unrouted)
IPL1  (1 unrouted)
IPL2  (1 unrouted)
PUNT  (1 unrouted)
RAM_A0  (4 unrouted)
RAM_A1  (4 unrouted)
RAM_A2  (4 unrouted)
RAM_A3  (4 unrouted)
RAM_A4  (4 unrouted)
RAM_A5  (4 unrouted)
RAM_A6  (4 unrouted)
RAM_A7  (4 unrouted)
RAM_A8  (4 unrouted)
RAM_A9  (4 unrouted)
RAM_MUX  (1 unrouted)
RAMOE  (4 unrouted)
RAS0  (2 unrouted)
RAS1  (2 unrouted)
RESET  (1 unrouted)
RW20  (5 unrouted)
SIZ0  (1 unrouted)
SIZ1  (1 unrouted)
TCK  (2 unrouted)
TDI  (1 unrouted)
TDINT  (1 unrouted)
TDO  (1 unrouted)
TMS  (2 unrouted)
VCC  (11 unrouted)
VCC33  (27 unrouted)

### Text on the board
Top: 1
Route2: 2
Route15: 3
Bottom: 4
tNames: Published under the / GNU Public License (GPL) v2 | mux | 8MB A1200 version designed / in 2019 by @edu_arana / Based on the TF328 by / Stephen Leary | TMS | TDI | TDO | TCK | GND | 3V3 | ram | 8MB Fast Ram For A1200 | v0.2 | E / D / U